# Altium schematic sheet Sheet1.SchDoc
size Letter; SheetNumber: 2; SheetTotal: 2
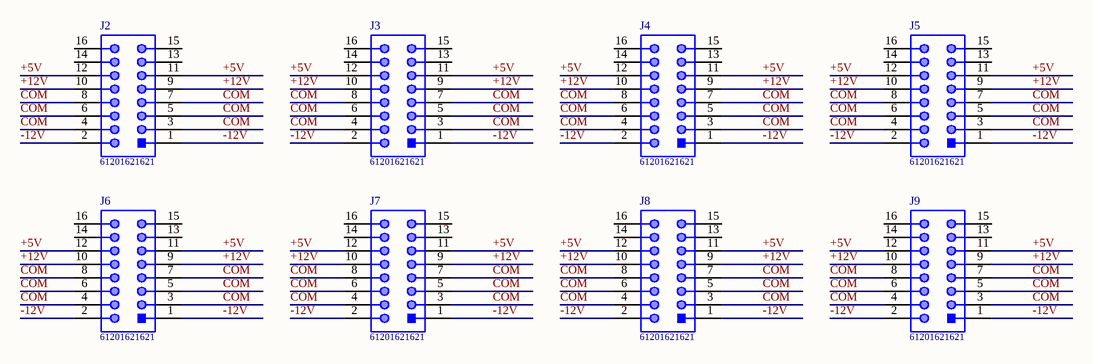
[diagram p0: Sheet1.SchDoc]

## Parts
J2  61201621621  [61201621621]
J3  61201621621  [61201621621]
J4  61201621621  [61201621621]
J5  61201621621  [61201621621]
J6  61201621621  [61201621621]
J7  61201621621  [61201621621]
J8  61201621621  [61201621621]
J9  61201621621  [61201621621]

## Nets
+5V: J2.11 J2.12 J3.11 J3.12 J4.11 J4.12 J5.11 J5.12 J6.11 J6.12 J7.11 J7.12 J8.11 J8.12 J9.11 J9.12
+12V: J2.9 J2.10 J3.9 J3.10 J4.9 J4.10 J5.9 J5.10 J6.9 J6.10 J7.9 J7.10 J8.9 J8.10 J9.9 J9.10
-12V: J2.1 J2.2 J3.1 J3.2 J4.1 J4.2 J5.1 J5.2 J6.1 J6.2 J7.1 J7.2 J8.1 J8.2 J9.1 J9.2
COM: J2.3 J2.4 J2.5 J2.6 J2.7 J2.8 J3.3 J3.4 J3.5 J3.6 J3.7 J3.8 J4.3 J4.4 J4.5 J4.6 J4.7 J4.8 J5.3 J5.4 J5.5 J5.6 J5.7 J5.8 J6.3 J6.4 J6.5 J6.6 J6.7 J6.8 J7.3 J7.4 J7.5 J7.6 J7.7 J7.8 J8.3 J8.4 J8.5 J8.6 J8.7 J8.8 J9.3 J9.4 J9.5 J9.6 J9.7 J9.8

Not connected (* = marked no-connect by the designer): J2 13 14 15 16; J3 13 14 15 16; J4 13 14 15 16; J5 13 14 15 16; J6 13 14 15 16; J7 13 14 15 16; J8 13 14 15 16; J9 13 14 15 16

## Library data of the parts
J2-J9 = CMP-1502-00009-1: Male Box Header WR-BHD, THT, Vertical, pitch 2.54 mm, 16 pins; Manufacturer: Wurth Elektronik; Pin Number: 16; Pitch: 2.54mm; Contact Resistance: 20mOhm; Working Voltage: 250VAC; Withstanding Voltage: 500VAC; Published Date: August2018; Gender: Male; Package Reference: 61201621621; Mounting Technology: THT; Part Number: 61201621621; Datasheet URL: https://katalog.we-online.de/em/datasheet/6120xx21621.pdf; Orientation: Vertical; Operating Temperature: -40to125degC; Manufacturer URL: http://www.we-online.de; Publisher: WurthElektronik; Packaging: Tray